# Altium schematic sheet Sheet5.SchDoc
size A4
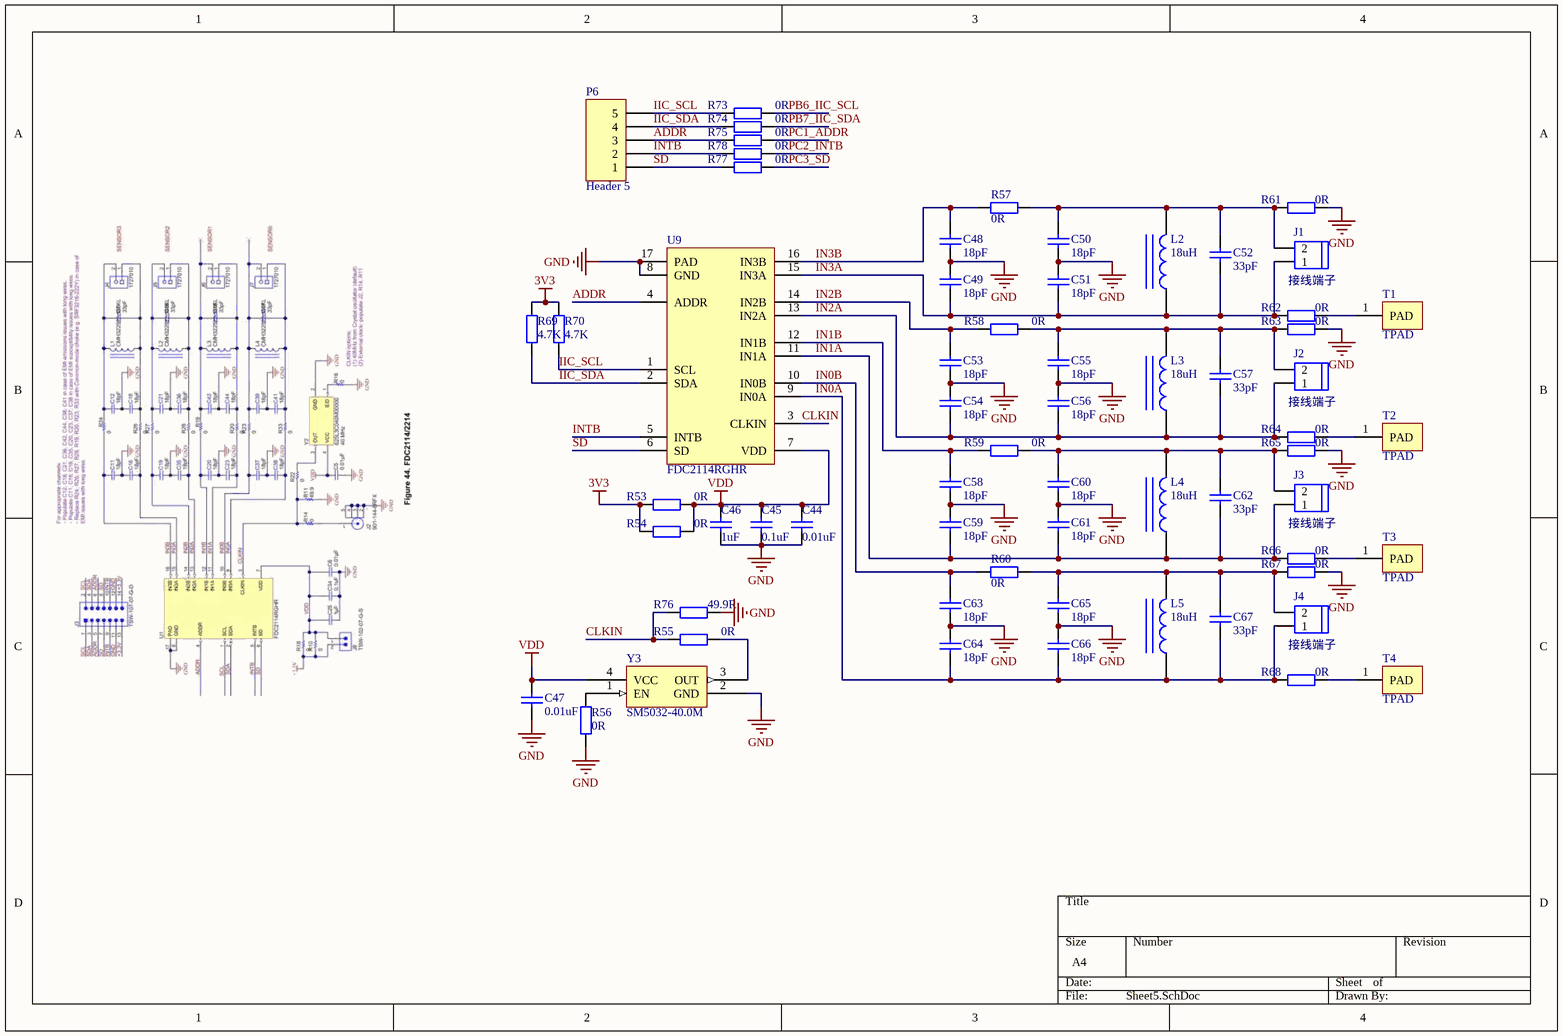
[diagram p0: Sheet5.SchDoc]

## Parts
C44  0.01uF  [LC-0603_C]
C45  0.1uF  [LC-0603_C]
C46  1uF  [LC-0603_C]
C47  0.01uF  [LC-0603_C]
C48  18pF  [LC-0603_C]
C49  18pF  [LC-0603_C]
C50  18pF  [LC-0603_C]
C51  18pF  [LC-0603_C]
C52  33pF  [LC-0603_C]
C53  18pF  [LC-0603_C]
C54  18pF  [LC-0603_C]
C55  18pF  [LC-0603_C]
C56  18pF  [LC-0603_C]
C57  33pF  [LC-0603_C]
C58  18pF  [LC-0603_C]
C59  18pF  [LC-0603_C]
C60  18pF  [LC-0603_C]
C61  18pF  [LC-0603_C]
C62  33pF  [LC-0603_C]
C63  18pF  [LC-0603_C]
C64  18pF  [LC-0603_C]
C65  18pF  [LC-0603_C]
C66  18pF  [LC-0603_C]
C67  33pF  [LC-0603_C]
J1  接线端子  [CON_2_5.08B]
J2  接线端子  [CON_2_5.08B]
J3  接线端子  [CON_2_5.08B]
J4  接线端子  [CON_2_5.08B]
L2  18uH  [LC-0805_L]
L3  18uH  [LC-0805_L]
L4  18uH  [LC-0805_L]
L5  18uH  [LC-0805_L]
P6  Header 5  [HDR1X5]
R53  0R  [LC-0603_R]
R54  0R  [LC-0603_R]
R55  0R  [LC-0603_R]
R56  0R  [LC-0603_R]
R57  0R  [LC-0603_R]
R58  0R  [LC-0603_R]
R59  0R  [LC-0603_R]
R60  0R  [LC-0603_R]
R61  0R  [LC-0603_R]
R62  0R  [LC-0603_R]
R63  0R  [LC-0603_R]
R64  0R  [LC-0603_R]
R65  0R  [LC-0603_R]
R66  0R  [LC-0603_R]
R67  0R  [LC-0603_R]
R68  0R  [LC-0603_R]
R69  4.7K  [LC-0603_R]
R70  4.7K  [LC-0603_R]
R73  0R  [LC-0603_R]
R74  0R  [LC-0603_R]
R75  0R  [LC-0603_R]
R76  49.9R  [LC-0603_R]
R77  0R  [LC-0603_R]
R78  0R  [LC-0603_R]
T1  TPAD  [TOUCH]
T2  TPAD  [TOUCH]
T3  TPAD  [TOUCH]
T4  TPAD  [TOUCH]
U9  FDC2114RGHR  [QFN16-05]
Y3  SM5032-40.0M  [XTAL_5032]

## Nets
3V3: R53.1 R54.1 R69.2 R70.2
GND: C44.1 C45.1 C46.1 C47.1 C48.1 C49.2 C50.1 C51.2 C53.1 C54.2 C55.1 C56.2 C58.1 C59.2 C60.1 C61.2 C63.1 C64.2 C65.1 C66.2 R56.1 R61.2 R63.2 R65.2 R67.2 R76.2 U9.8(GND) U9.17(PAD) Y3.2(GND)
VDD: C44.2 C45.2 C46.2 C47.2 R53.2 R54.2 U9.7(VDD) Y3.4(VCC)
ADDR: P6.3 R75.1 U9.4(ADDR)
CLKIN: R55.1 R76.1 U9.3(CLKIN)
IIC_SCL: P6.5 R70.1 R73.1 U9.1(SCL)
IIC_SDA: P6.4 R69.1 R74.1 U9.2(SDA)
IN0A: C64.1 C66.1 C67.1 J4.1 L5.1 R68.1 U9.9(IN0A)
IN0B: C63.2 R60.1 U9.10(IN0B)
IN1A: C59.1 C61.1 C62.1 J3.1 L4.1 R66.1 U9.11(IN1A)
IN1B: C58.2 R59.1 U9.12(IN1B)
IN2A: C54.1 C56.1 C57.1 J2.1 L3.1 R64.1 U9.13(IN2A)
IN2B: C53.2 R58.1 U9.14(IN2B)
IN3A: C49.1 C51.1 C52.1 J1.1 L2.1 R62.1 U9.15(IN3A)
IN3B: C48.2 R57.1 U9.16(IN3B)
INTB: P6.2 R78.1 U9.5(INTB)
PB6_IIC_SCL: R73.2
PB7_IIC_SDA: R74.2
PC1_ADDR: R75.2
PC2_INTB: R78.2
PC3_SD: R77.2
SD: P6.1 R77.1 U9.6(SD)
NetC50_2: C50.2 C52.2 J1.2 L2.2 R57.2 R61.1
NetC55_2: C55.2 C57.2 J2.2 L3.2 R58.2 R63.1
NetC60_2: C60.2 C62.2 J3.2 L4.2 R59.2 R65.1
NetC65_2: C65.2 C67.2 J4.2 L5.2 R60.2 R67.1
NetR55_2: R55.2 Y3.3(OUT)
NetR56_2: R56.2 Y3.1(EN)
NetR62_2: R62.2 T1.1(PAD)
NetR64_2: R64.2 T2.1(PAD)
NetR66_2: R66.2 T3.1(PAD)
NetR68_2: R68.2 T4.1(PAD)

## Library data of the parts
C44-C67 = 0603 1uF (105) 10% 50V: 贴片电容; ComponentLink1Description: 供应商链接; ComponentLink1URL: http://www.szlcsc.com/product/details_16531.html; Package: 0603; Supplier: LC; SuppliersPartNumber: C15849
J1-J4 = HEAD2
L2-L5 = 0805 47uH 10%: 贴片电感; ComponentLink1URL: http://www.szlcsc.com/product/details_14964.html; Package: 0805; Supplier: LC; SuppliersPartNumber: C14304
P6 = Header 5: Header, 5-Pin; LatestRevisionDate: 17-Jul-2002; LatestRevisionNote: Re-released for DXP Platform.; Publisher: Altium Limited
R53-R70 R73-R78 = 0603 1.5KΩ (1501) 1%: 贴片电阻; ComponentLink1Description: 供应商链接; ComponentLink1URL: http://www.szlcsc.com/product/details_23570.html; Package: 0603; Supplier: LC; SuppliersPartNumber: C22843
T1-T4 = TPAD: 触摸按键
U9 = FDC2114RGHR: 电容检测传感器
Y3 = SM5032: 有源晶振